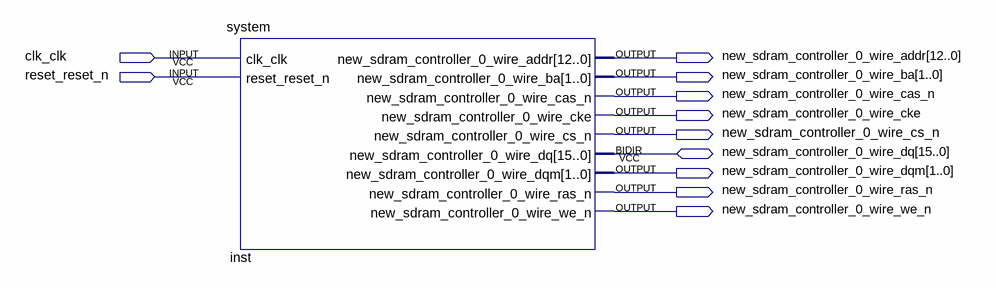
[diagram p0: schematic sheet]
// Quartus schematic 3D.bdf as structural Verilog: 1 symbols, 11 pins
module \3D  (
  input  clk_clk,
  input  reset_reset_n,
  inout  [15:0] new_sdram_controller_0_wire_dq,
  output [12:0] new_sdram_controller_0_wire_addr,
  output [1:0] new_sdram_controller_0_wire_ba,
  output new_sdram_controller_0_wire_cas_n,
  output new_sdram_controller_0_wire_cke,
  output new_sdram_controller_0_wire_cs_n,
  output [1:0] new_sdram_controller_0_wire_dqm,
  output new_sdram_controller_0_wire_ras_n,
  output new_sdram_controller_0_wire_we_n
);

  system inst (
    .clk_clk(clk_clk), .reset_reset_n(reset_reset_n),
    .new_sdram_controller_0_wire_addr(new_sdram_controller_0_wire_addr),
    .new_sdram_controller_0_wire_ba(new_sdram_controller_0_wire_ba),
    .new_sdram_controller_0_wire_cas_n(new_sdram_controller_0_wire_cas_n),
    .new_sdram_controller_0_wire_cke(new_sdram_controller_0_wire_cke),
    .new_sdram_controller_0_wire_cs_n(new_sdram_controller_0_wire_cs_n),
    .new_sdram_controller_0_wire_dqm(new_sdram_controller_0_wire_dqm),
    .new_sdram_controller_0_wire_ras_n(new_sdram_controller_0_wire_ras_n),
    .new_sdram_controller_0_wire_we_n(new_sdram_controller_0_wire_we_n),
    .new_sdram_controller_0_wire_dq(new_sdram_controller_0_wire_dq));
endmodule
